# Altium schematic sheet Regulator.SchDoc
size A4
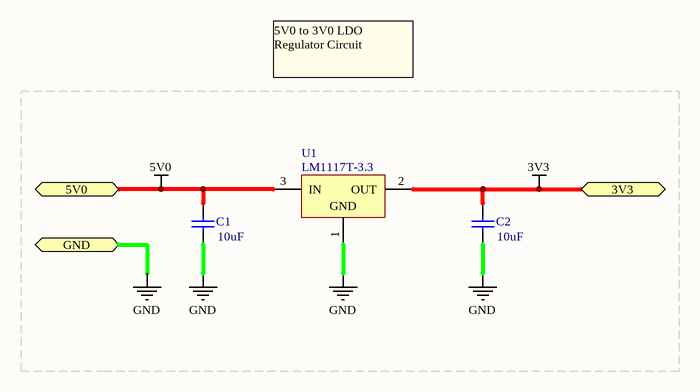
[diagram p0: Regulator.SchDoc]

## Parts
C1  value 10uF  [RAD-0.3]  (hidden comment: Cap)
C2  value 10uF  [RAD-0.3]  (hidden comment: Cap)
U1  LM1117T-3.3  [T03B]

## Ports
3V3, 5V0, GND

## Nets
3V3: C2.2 U1.2(OUT) ; port 3V3
5V0: C1.2 U1.3(IN) ; port 5V0
GND: C1.1 C2.1 U1.1(GND) ; port GND

## Notes on the sheet
- 5V0 to 3V0 LDO
  Regulator Circuit

## Library data of the parts
C1 C2 = Cap: Capacitor; Published: 8-Jun-2000; LatestRevisionDate: 17-Jul-2002; LatestRevisionNote: Re-released for DXP Platform.; PackageReference: RAD-0.3; Publisher: Altium Limited; PackageDescription: Radial Cap, Thru-Hole; 2 Leads; 0.3 in Pin Spacing
U1 = CMP-0062-02490-2: 800mA Low-Dropout Linear Regulator, 3-pin TO-220; Manufacturer: National Semiconductor; PowerWise: N; CompType: LDO IC; PackageTopMarking: NSUZXYTTE#*LM1117T*3.3; ComponentLink1Description: LM1117 Datasheet; RoHS: N; PinCount: 3; DatasheetVersion: Apr-2006; PackageDescription: TO-220, Molded, 3 Lead, Straight; ComponentLink2URL: http://www.national.com/pf/LM/LM1117.html; ComponentLink2Description: LM1117 Web Page; RevisionNote: Component URLs added; ComponentLink3Description: T03B Package Page; PackageReference: T03B; ComponentLink1URL: http://www.national.com/ds/LM/LM1117.pdf; PackageVersion: revL, Jan-1992; ComponentLink3URL: http://www.national.com/packaging/folders/t03b.html